# EasyEDA Pro project ProPrj_ESP32_四足机器人_2025-01-06.epro

# Schematic SCH_ESP32_四足机器人
Board Name: Board1_1; Create Date: 2024-11-19; Page Name: P1; Project Name: 毕设; Schematic Name: Schematic1_1; Update Date: 2024-11-26; Company: 嘉立创EDA; Page Size: A4; Version: V1.0
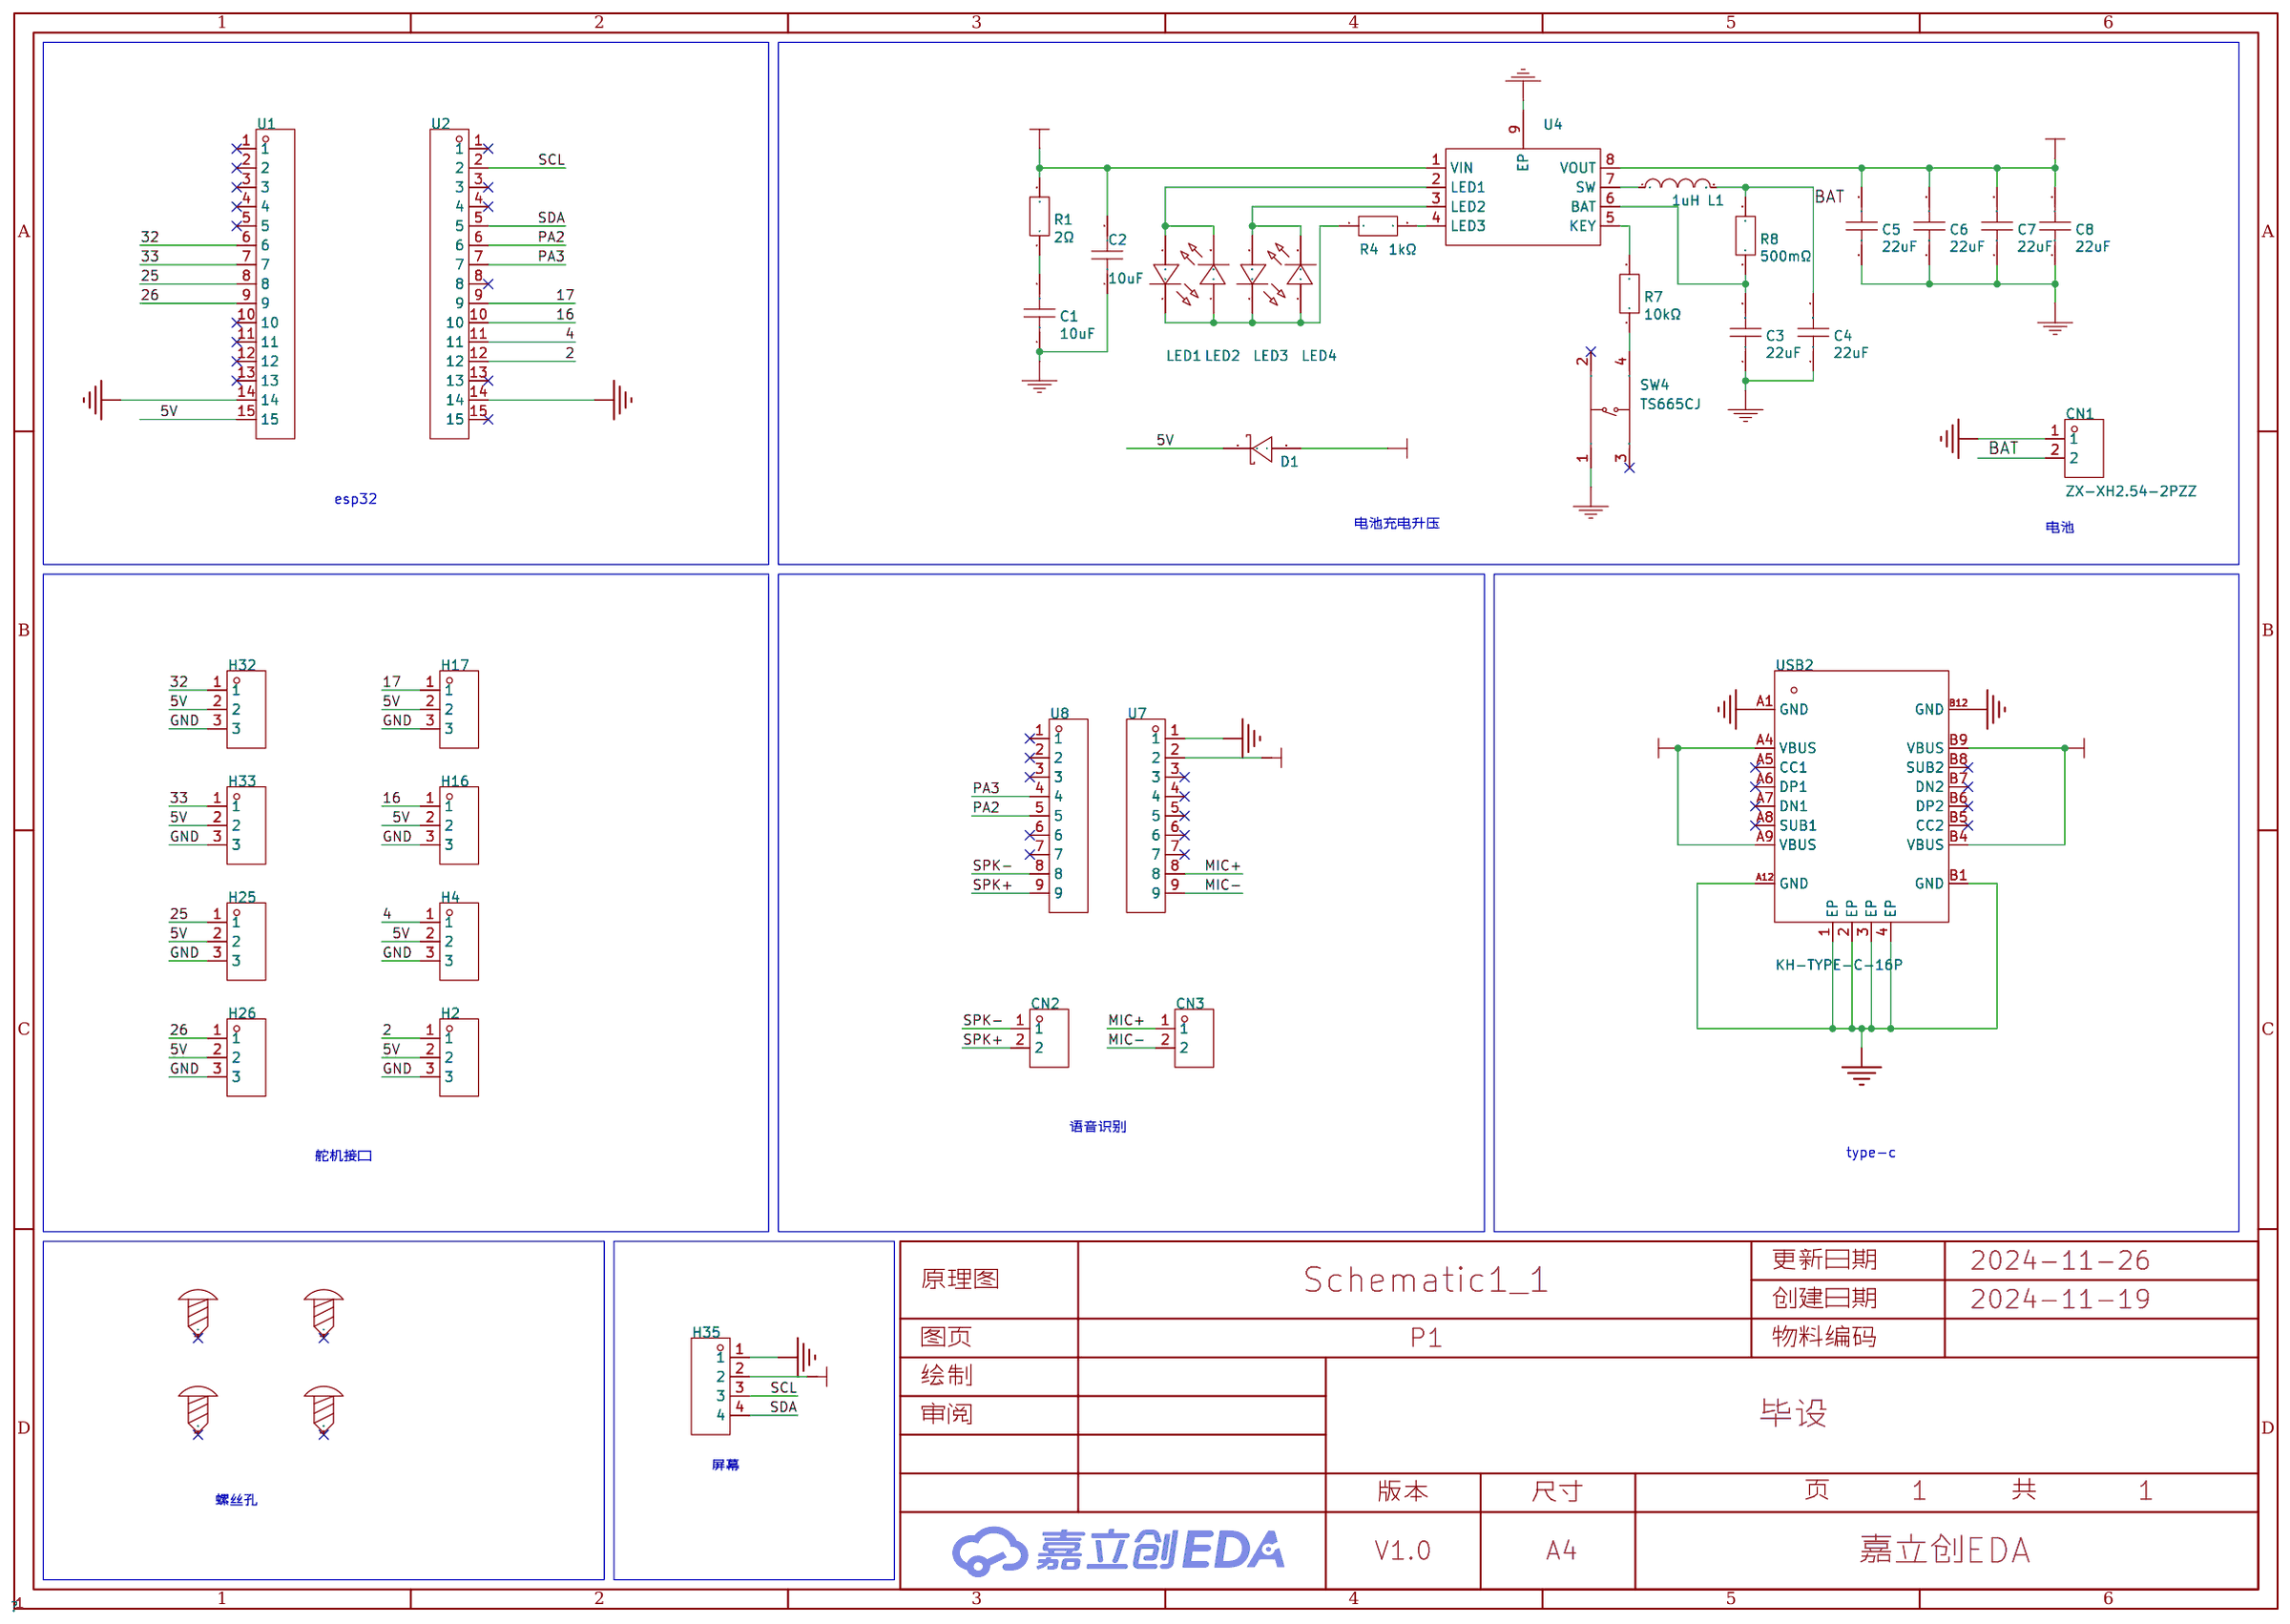
[diagram p0: schematic sheet]

## Parts
C1  10uF  [C0805]
C2  10uF  [C0805]
C3  22uF  [C0805]
C4  22uF  [C0805]
C5  22uF  [C0805]
C6  22uF  [C0805]
C7  22uF  [C0805]
C8  22uF  [C0805]
CN1  ZX-XH2.54-2PZZ  [CONN-TH_2P-P2.50_HX25003-2A]
CN2  ZX-XH2.54-2PZZ  [CONN-TH_2P-P2.50_HX25003-2A]
CN3  ZX-XH2.54-2PZZ  [CONN-TH_2P-P2.50_HX25003-2A]
D1  SS32  [SMA_L4.4-W2.8-LS5.4-RD]
H2  PZ254V-11-03P  [HDR-TH_3P-P2.54-V-M]
H4  PZ254V-11-03P  [HDR-TH_3P-P2.54-V-M]
H16  PZ254V-11-03P  [HDR-TH_3P-P2.54-V-M]
H17  PZ254V-11-03P  [HDR-TH_3P-P2.54-V-M]
H25  PZ254V-11-03P  [HDR-TH_3P-P2.54-V-M]
H26  PZ254V-11-03P  [HDR-TH_3P-P2.54-V-M]
H32  PZ254V-11-03P  [HDR-TH_3P-P2.54-V-M]
H33  PZ254V-11-03P  [HDR-TH_3P-P2.54-V-M]
H35  2.54-1*4P母  [HDR-TH_4P-P2.54-V-F]
L1  1uH  [IND-SMD_L7.1-W6.5-P5.60]
LED1  NCD0805G1  [LED0805-R-RD]
LED2  NCD0805G1  [LED0805-R-RD]
LED3  NCD0805G1  [LED0805-R-RD]
LED4  NCD0805G1  [LED0805-R-RD]
R1  2Ω  [R0805]
R4  1kΩ  [R0805]
R7  10kΩ  [R0805]
R8  500mΩ  [R0805]
SCREW1  -  [M4螺丝]
SCREW2  -  [M4螺丝]
SCREW3  -  [M4螺丝]
SCREW4  -  [M4螺丝]
SW4  TS665CJ  [SW-TH_4P-L6.0-W6.0-P4.50-LS6.5]
U1  KH-2.54FH-1X15P-H8.5  [HDR-TH_15P-P2.54-V-F]
U2  KH-2.54FH-1X15P-H8.5  [HDR-TH_15P-P2.54-V-F]
U4  IP5306  [ESOP-8_L4.9-W3.9-P1.27-LS6.0-BL-EP]
U7  PM254-1-09-Z-8.5  [HDR-TH_9P-P2.54-V-F]
U8  PM254-1-09-Z-8.5  [HDR-TH_9P-P2.54-V-F]
USB2  KH-TYPE-C-16P  [usb-c-smd_kh-type-c-16p]

## Library data of the parts
C1 C2 = CL21A106KPFNNNE: 容值:10uF;精度:±10%;额定电压:10V;材质(温度系数):X5R;; LCSC Part Name: 10uF ±10% 10V; Supplier Part: C17024; Manufacturer: SAMSUNG(三星); Supplier Footprint: 0805; JLCPCB Part Class: Extended Part; Datasheet: https://atta.szlcsc.com/upload/public/pdf/source/20160218/1457707763339.pdf; Supplier: LCSC; Tolerance: ±10%; Voltage Rated: 10V; Temperature Coefficient: X5R
C3-C8 = CL21A226MPQNNNE: 容值:22uF;精度:±20%;额定电压:10V;材质(温度系数):X5R;; LCSC Part Name: 22uF ±20% 10V; Supplier Part: C29277; Manufacturer: SAMSUNG(三星); Supplier Footprint: 0805; JLCPCB Part Class: Extended Part; Datasheet: https://atta.szlcsc.com/upload/public/pdf/source/20160218/1457707763339.pdf; Supplier: LCSC; Tolerance: ±20%; Voltage Rated: 10V; Temperature Coefficient: X5R
CN1-CN3 = ZX-XH2.54-2PZZ: 插针结构:1x2P;间距:2.54mm;安装方式:直插;参考系列:XH;总PIN数:2P;排数:1;每排PIN数:2;行距:-;额定电流:3A;触头材质:黄铜;触头镀层:锡;工作温度范围:-25℃~+85℃;; Supplier Part: C7429632; Manufacturer: Megastar(兆星); Supplier Footprint: 插件,P=2.54mm; JLCPCB Part Class: 扩展库; Datasheet: https://atta.szlcsc.com/upload/public/pdf/source/20230619/19BA6947230AA44A04D3EDD65E618FD0.pdf; Supplier: LCSC; Pins Structure: 1x2P; Pitch: 2.54mm; Mounting Style: 直插; Reference Series: XH; Number of Pins: 2P; Number of Rows: 1; Number of PINs Per Row: 2; Current Rating (Max): 3A; Contact Material: 黄铜; Contact Plating: 锡; Operating Temperature Range: -25℃~+85℃
D1 = SS32_C123938: 正向压降(Vf):550mV@3A;直流反向耐压(Vr):20V;平均整流电流(Io):3A;; LCSC Part Name: 电压:20V 电流:3A; Supplier Part: C123938; Manufacturer: 晶导微电子; Supplier Footprint: SMA(DO-214AC); JLCPCB Part Class: Extended Part; Datasheet: https://atta.szlcsc.com/upload/public/pdf/source/20170804/C123938_1501836222047866178.pdf; Supplier: LCSC; Forward Voltage (Vf@If): 550mV@3A; Reverse Voltage (Vr): 20V; Average Rectified Current (Io): 3A; Reverse Leakage Current (Ir): 500uA@20V; Peak forward surge current: 80A; JLCPCB SMD: Yes
H2 H4 H16 H17 H25 H26 H32 H33 = PZ254V-11-03P: 插针结构:1x3P;间距:2.54mm;行距:-;圆针/方针:方针;安装类型:直插;排数:单排;总PIN位数:3P;额定电流:3A;额定电压:250V;配合针长度:6mm;塑高:2.5mm;端接针长度:3mm;工作温度范围:-40℃~+105℃;颜色:黑色;; LCSC Part Name: 间距:2.54mm 1x3P 直插 方针; Supplier Part: C2937625; Manufacturer: XFCN(兴飞); Supplier Footprint: 插件,P=2.54mm; JLCPCB Part Class: 扩展库; Datasheet: https://atta.szlcsc.com/upload/public/pdf/source/20200309/C492402_8335C3D49C4E4C618838D59BB1D024C1.pdf; Supplier: LCSC; Pin Structure: 1x3P; Pitch: 2.54mm; Circluar Pins/Square Pins: 方针; Mounting Type: 直插; Number of Rows: 单排; Number of Pins: 3P; Current Rating (Max): 3A; Voltage Rating (Max): 250V; Length of Mating Pin: 6mm; Insulation Height: 2.5mm; Length of End Connection Pin: 3mm; Operating Temperature Range: -40℃~+105℃; Color: 黑色
H35 = 2.54-1*4P母: 插孔结构:1x4P;间距:2.54mm;行距:-;圆孔/方孔:方孔;安装类型:直插;排数:单排;总孔位数:4P;额定电流:3A;额定电压:-;插孔方向:顶部;塑高:-;触头材质:青铜;触头镀层:-;工作温度范围:-40℃~+105℃;焊接温度(最大值):-;; LCSC Part Name: 间距:2.54mm 1x4P 直插; Supplier Part: C2718488; Manufacturer: BOOMELE(博穆精密); Supplier Footprint: 插件,P=2.54mm; JLCPCB Part Class: 扩展库; Datasheet: https://atta.szlcsc.com/upload/public/pdf/source/20210301/C2718488_F4427B881E42CAA8DDB0B1C12B3A522C.pdf; Supplier: LCSC; Holes Structure: 1x4P; Pitch: 2.54mm; Circular Hole / Square Hole: 方孔; Mounting Type: 直插; Number of Rows: 单排; Number of Holes: 4P; Current Rating (Max): 3A; Holes Direction: 顶部; Contact Material: 青铜; Operating Temperature Range: -40℃~+105℃
L1 = SPM6530T-1R0M120: 电感值:1uH;精度:±20%;额定电流:13A;饱和电流(Isat):14.1A;类型:-;; LCSC Part Name: 1uH ±20% 14.1A; Supplier Part: C87572; Manufacturer: TDK; Supplier Footprint: SMD,7.1x6.5mm; JLCPCB Part Class: Extended Part; Datasheet: https://atta.szlcsc.com/upload/public/pdf/source/20161112/1478931671443.pdf; Supplier: LCSC; Tolerance: ±20%; Rated Current: 13A; Saturation Current (Isat): 14.1A; DC Resistance (DCR): 7.81mΩ
LED1-LED4 = NCD0805G1: 发光颜色:翠绿色;正向电压(VF):2.5V~3.6V;功率:72mW;正向电流:5mA;主波长:525nm~537.5nm;透镜颜色:无色透明透镜;发光强度:180mcd~400mcd;发光角度:130°;工作温度:-30℃~+85℃;; Supplier Part: C84260; Manufacturer: 国星光电; Supplier Footprint: 0805; JLCPCB Part Class: Extended Part; Datasheet: https://atta.szlcsc.com/upload/public/pdf/source/20200820/C84260_AFC7BF57C6FBA034D182BB8D10A67EFE.pdf; Supplier: LCSC; Emitted Color: 翠绿色; Forward Voltage (VF): 2.5V~3.6V; Power Dissipation: 72mW; Forward Current: 5mA; Dominant Wavelength: 525nm~537.5nm; Lens Color: 无色透明透镜; Luminous Intensity: 180mcd~400mcd; Viewing Angle: 130°; Operating Temperature: -30℃~+85℃
R1 = FRC0805J2R0TS: 电阻类型:厚膜电阻;阻值:2Ω;精度:±5%;功率:125mW;最大工作电压:150V;温度系数:±200ppm/℃;; LCSC Part Name: 2Ω ±5% 125mW 厚膜电阻; Supplier Part: C2930265; Manufacturer: FOJAN(富捷); Supplier Footprint: 0805; JLCPCB Part Class: Extended Part; Datasheet: https://atta.szlcsc.com/upload/public/pdf/source/20211221/925EC7D7225764EE0046F22065062C87.pdf; Supplier: LCSC; Type: 厚膜电阻; Tolerance: ±5%; Power(Watts): 125mW; Overload Voltage (Max): 150V; Temperature Coefficient: ±200ppm/℃; Operating Temperature Range: -55℃~+155℃
R4 = 0805W8F1001T5E: 电阻类型:厚膜电阻;阻值:1kΩ;精度:±1%;功率:125mW;最大工作电压:150V;温度系数:±100ppm/℃;; LCSC Part Name: 1kΩ ±1% 125mW 厚膜电阻; Supplier Part: C17513; Manufacturer: UNI-ROYAL(厚声); Supplier Footprint: 0805; JLCPCB Part Class: Basic Part; Datasheet: https://atta.szlcsc.com/upload/public/pdf/source/20200306/C422600_1E6D84923E4A46A82E41ADD87F860B5C.pdf; Supplier: LCSC; Type: 厚膜电阻; Tolerance: ±1%; Power(Watts): 125mW; Overload Voltage (Max): 150V; Temperature Coefficient: ±100ppm/℃; Operating Temperature Range: -55℃~+155℃
R7 = 0805W8F1002T5E_C17414: 电阻类型:厚膜电阻;阻值:10kΩ;精度:±1%;功率:125mW;最大工作电压:150V;温度系数:±100ppm/℃;; LCSC Part Name: 10kΩ ±1% 125mW 厚膜电阻; Supplier Part: C17414; Manufacturer: UNI-ROYAL(厚声); Manufacturer Part: 0805W8F1002T5E; Supplier Footprint: 0805; JLCPCB Part Class: Basic Part; Datasheet: https://atta.szlcsc.com/upload/public/pdf/source/20200306/C422600_1E6D84923E4A46A82E41ADD87F860B5C.pdf; Supplier: LCSC; Type: 厚膜电阻; Tolerance: ±1%; Power(Watts): 125mW; Overload Voltage (Max): 150V; Temperature Coefficient: ±100ppm/℃; Operating Temperature Range: -55℃~+155℃
R8 = FRL0805JR500TS: 电阻类型:厚膜电阻;阻值:500mΩ;精度:±5%;功率:125mW;最大工作电压:300V;温度系数:±300ppm/℃;; LCSC Part Name: 500mΩ ±5% 125mW 厚膜电阻; Supplier Part: C2934281; Manufacturer: FOJAN(富捷); Supplier Footprint: 0805; JLCPCB Part Class: Extended Part; Datasheet: https://atta.szlcsc.com/upload/public/pdf/source/20211221/925EC7D7225764EE0046F22065062C87.pdf; Supplier: LCSC; Type: 厚膜电阻; Tolerance: ±5%; Power(Watts): 125mW; Overload Voltage (Max): 300V; Temperature Coefficient: ±300ppm/℃; Operating Temperature Range: -55℃~+155℃
SCREW1-SCREW4 = M4螺丝: Supplier Footprint: 插件; Check: false
SW4 = TS665CJ: 电路结构:单刀单掷;按钮形状:圆形按钮;安装方式:直插;开关长度:6mm;开关宽度:6mm;开关高度:5mm;触点电流:50mA;额定电压(DC):12V;带灯:-;机械寿命:-;; LCSC Part Name: 6*6*5mm 直插 轻触开关; Supplier Part: C393938; Manufacturer: SHOU HAN(首韩); Supplier Footprint: 插件; JLCPCB Part Class: 扩展库; Datasheet: https://atta.szlcsc.com/upload/public/pdf/source/20190521/C393938_BDABEAC600B4C55E200A80AA129B70BC.pdf; Supplier: LCSC; Circuit: 单刀单掷; Actuator Style: 圆形按钮; Mounting Style: 直插; Switch Length: 6mm; Switch Width: 6mm; Switch Height: 5mm; Contact Current: 50mA; Voltage Rating (DC): 12V
U1 U2 = KH-2.54FH-1X15P-H8.5: 插孔结构:1x15P;间距:2.54mm;行距:-;圆孔/方孔:方孔;安装类型:直插;排数:单排;总孔位数:15P;额定电流:3A;额定电压:-;插孔方向:顶部;塑高:8.5mm;工作温度范围:-40℃~+105℃;; LCSC Part Name: 间距:2.54mm 1x15P 直插; Supplier Part: C2932676; Manufacturer: kinghelm(金航标); Supplier Footprint: 插件,P=2.54mm; JLCPCB Part Class: 扩展库; Datasheet: https://atta.szlcsc.com/upload/public/pdf/source/20211220/977AA415CFA981E866620A80068F25CA.pdf; Supplier: LCSC; Holes Structure: 1x15P; Pitch: 2.54mm; Circular Hole / Square Hole: 方孔; Mounting Type: 直插; Number of Rows: 单排; Number of Holes: 15P; Current Rating (Max): 3A; Holes Direction: 顶部; Insulation Height: 8.5mm; Operating Temperature Range: -40℃~+105℃; Check: true
U4 = IP5306: 2.1A充电2.4A放电高集成度移动电源SOC; Supplier Part: C181692; Manufacturer: INJOINIC(英集芯); Supplier Footprint: ESOP-8; JLCPCB Part Class: Extended Part; Datasheet: https://atta.szlcsc.com/upload/public/pdf/source/20190627/C384572_9925B3DDC4041BC6108E5AB46A2A0AB1.pdf; Supplier: LCSC
U7 = PM254-1-09-Z-8.5: 插孔结构:1x9P;间距:2.54mm;行距:-;圆孔/方孔:方孔;安装类型:直插;排数:单排;总孔位数:9P;额定电流:3A;额定电压:-;插孔方向:顶部;塑高:8.5mm;触头材质:铜合金;工作温度范围:-40℃~+105℃;焊接温度(最大值):260℃@5S;; LCSC Part Name: 1x9P 间距:2.54mm 直插; Supplier Part: C2897372; Manufacturer: HCTL(华灿天禄); Supplier Footprint: 插件,P=2.54mm; JLCPCB Part Class: 扩展库; Datasheet: https://atta.szlcsc.com/upload/public/pdf/source/20230609/534BE42964C679BDE98E061007C4ABD6.pdf; Supplier: LCSC; Holes Structure: 1x9P; Pitch: 2.54mm; Circular Hole / Square Hole: 方孔; Mounting Type: 直插; Number of Rows: 单排; Number of Holes: 9P; Current Rating (Max): 3A; Holes Direction: 顶部; Insulation Height: 8.5mm; Contact Material: 铜合金; Operating Temperature Range: -40℃~+105℃; Soldering Temperature(Max): 260℃@5S
U8 = PM254-1-09-Z-8.5: 插孔结构:1x9P;间距:2.54mm;行距:-;圆孔/方孔:方孔;安装类型:直插;排数:单排;总孔位数:9P;额定电流:3A;额定电压:-;插孔方向:顶部;塑高:8.5mm;触头材质:铜合金;工作温度范围:-40℃~+105℃;焊接温度(最大值):260℃@5S;; LCSC Part Name: 1x9P 间距:2.54mm 直插; Supplier Part: C2897372; Manufacturer: HCTL(华灿天禄); Supplier Footprint: 插件,P=2.54mm; JLCPCB Part Class: Extended Part; Datasheet: https://atta.szlcsc.com/upload/public/pdf/source/20230609/534BE42964C679BDE98E061007C4ABD6.pdf; Supplier: LCSC; Holes Structure: 1x9P; Pitch: 2.54mm; Circular Hole / Square Hole: 方孔; Mounting Type: 直插; Number of Rows: 单排; Number of Holes: 9P; Current Rating (Max): 3A; Holes Direction: 顶部; Insulation Height: 8.5mm; Contact Material: 铜合金; Operating Temperature Range: -40℃~+105℃; Soldering Temperature(Max): 260℃@5S
USB2 = KH-TYPE-C-16P: 连接器类型:Type-C;标准:-;公母:母;端口数量:1;触点数量:16P;安装方式:卧贴;额定电流 - 电源:3A;工作温度范围:-40℃~+85℃;; LCSC Part Name: Type-C 母 卧贴; Supplier Part: C709357; Manufacturer: kinghelm(金航标); Supplier Footprint: SMD; JLCPCB Part Class: 扩展库; Datasheet: https://atta.szlcsc.com/upload/public/pdf/source/20200911/C709357_AA8DCEB38BB20E3035A7ED7AE7667837.pdf; Supplier: LCSC; Connector Type: Type-C; Gender: 母; Number of Ports: 1; Number of Contacts: 16P; Mounting Style: 卧贴; Current Rating - Power (Max): 3A; Operating Temperature Range: -40℃~+85℃

## Nets
5V: D1.1(K) H2.2 H4.2 H16.2 H17.2 H25.2 H26.2 H32.2 H33.2 H35.2 U1.15 U7.2
5VOUT: C5.2 C6.2 C7.2 C8.2 D1.2(A) U4.8(VOUT)
GND: C1.1 C2.1 C3.1 C4.1 C5.1 C6.1 C7.1 C8.1 CN1.1 H2.3 H4.3 H16.3 H17.3 H25.3 H26.3 H32.3 H33.3 H35.1 SW4.1(A) U1.14 U2.14 U4.9(EP) U7.1 USB2.1(EP) USB2.2(EP) USB2.3(EP) USB2.4(EP) USB2.A1(GND) USB2.A12(GND) USB2.B1(GND) USB2.B12(GND)
VIN: C2.2 R1.2 U4.1(VIN) USB2.A4(VBUS) USB2.A9(VBUS) USB2.B4(VBUS) USB2.B9(VBUS)
2: H2.1 U2.12
4: H4.1 U2.11
16: H16.1 U2.10
17: H17.1 U2.9
25: H25.1 U1.8
26: H26.1 U1.9
32: H32.1 U1.6
33: H33.1 U1.7
BAT: C4.2 CN1.2 L1.2 R8.2
MIC+: CN3.1 U7.8
MIC-: CN3.2 U7.9
PA2: U2.6 U8.5
PA3: U2.7 U8.4
SCL: H35.3 U2.2
SDA: H35.4 U2.5
SPK+: CN2.2 U8.9
SPK-: CN2.1 U8.8
$1N4161: L1.1 U4.7(SW)
$1N4164: R7.2 U4.5(KEY)
$1N4167: C3.2 R8.1 U4.6(BAT)
$1N4173: LED1.1 LED2.2 U4.2(LED1)
$1N4198: R4.2 U4.4(LED3)
$1N4199: C1.2 R1.1
$1N19106: R7.1 SW4.4(D)
Net-(LED1-2): LED1.2 LED2.1 LED3.2 LED4.1 R4.1
Net-(LED3-1): LED3.1 LED4.2 U4.3(LED2)

Not connected (* = marked no-connect by the designer): SCREW1 1*; SCREW2 1*; SCREW3 1*; SCREW4 1*; SW4 2(B)* 3(C)*; U1 1* 2* 3* 4* 5* 10* 11* 12* 13*; U2 1* 3* 4* 8* 13* 15*; U7 3* 4* 5* 6* 7*; U8 1* 2* 3* 6* 7*; USB2 A5(CC1)* A6(DP1)* A7(DN1)* A8(SUB1)* B5(CC2)* B6(DP2)* B7(DN2)* B8(SUB2)*

## Notes on the sheet
- esp32
- 电池充电升压
- 电池
- 语音识别
- 舵机接口
- type-c
- 屏幕
- 螺丝孔

# Board PCB_ESP32_四足机器人
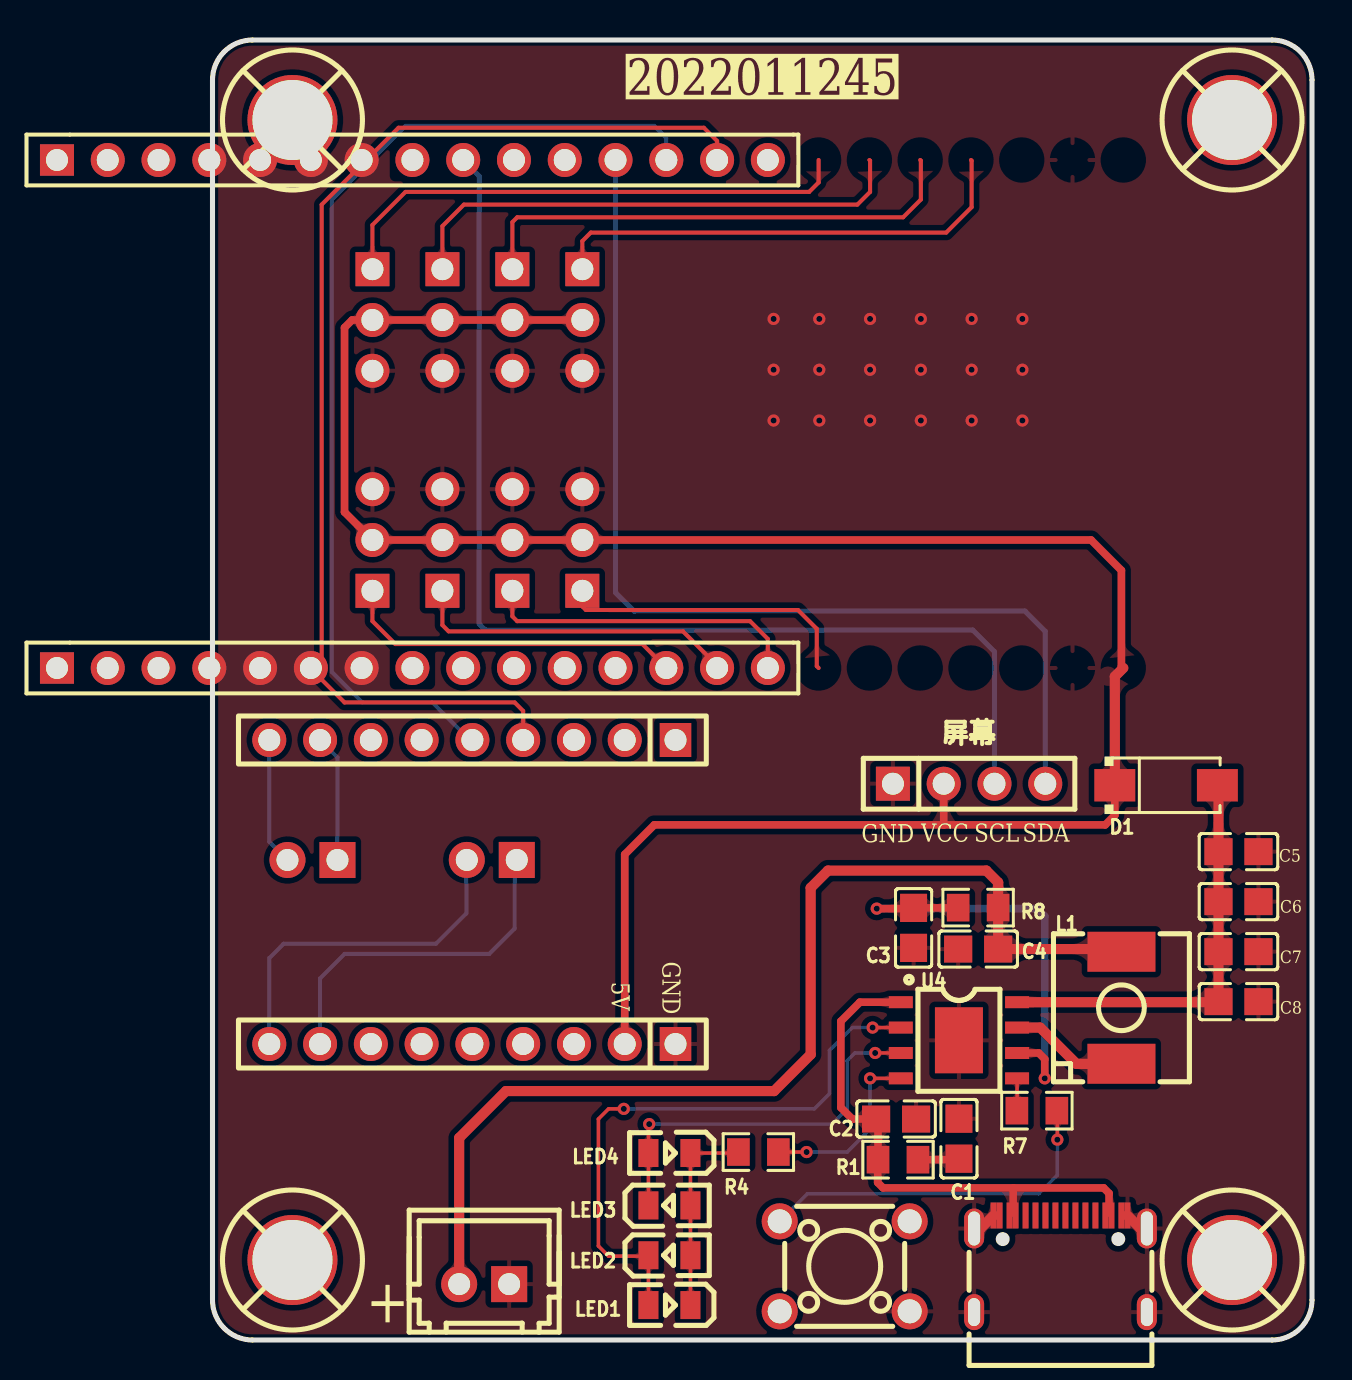
[diagram p1: board, top side]
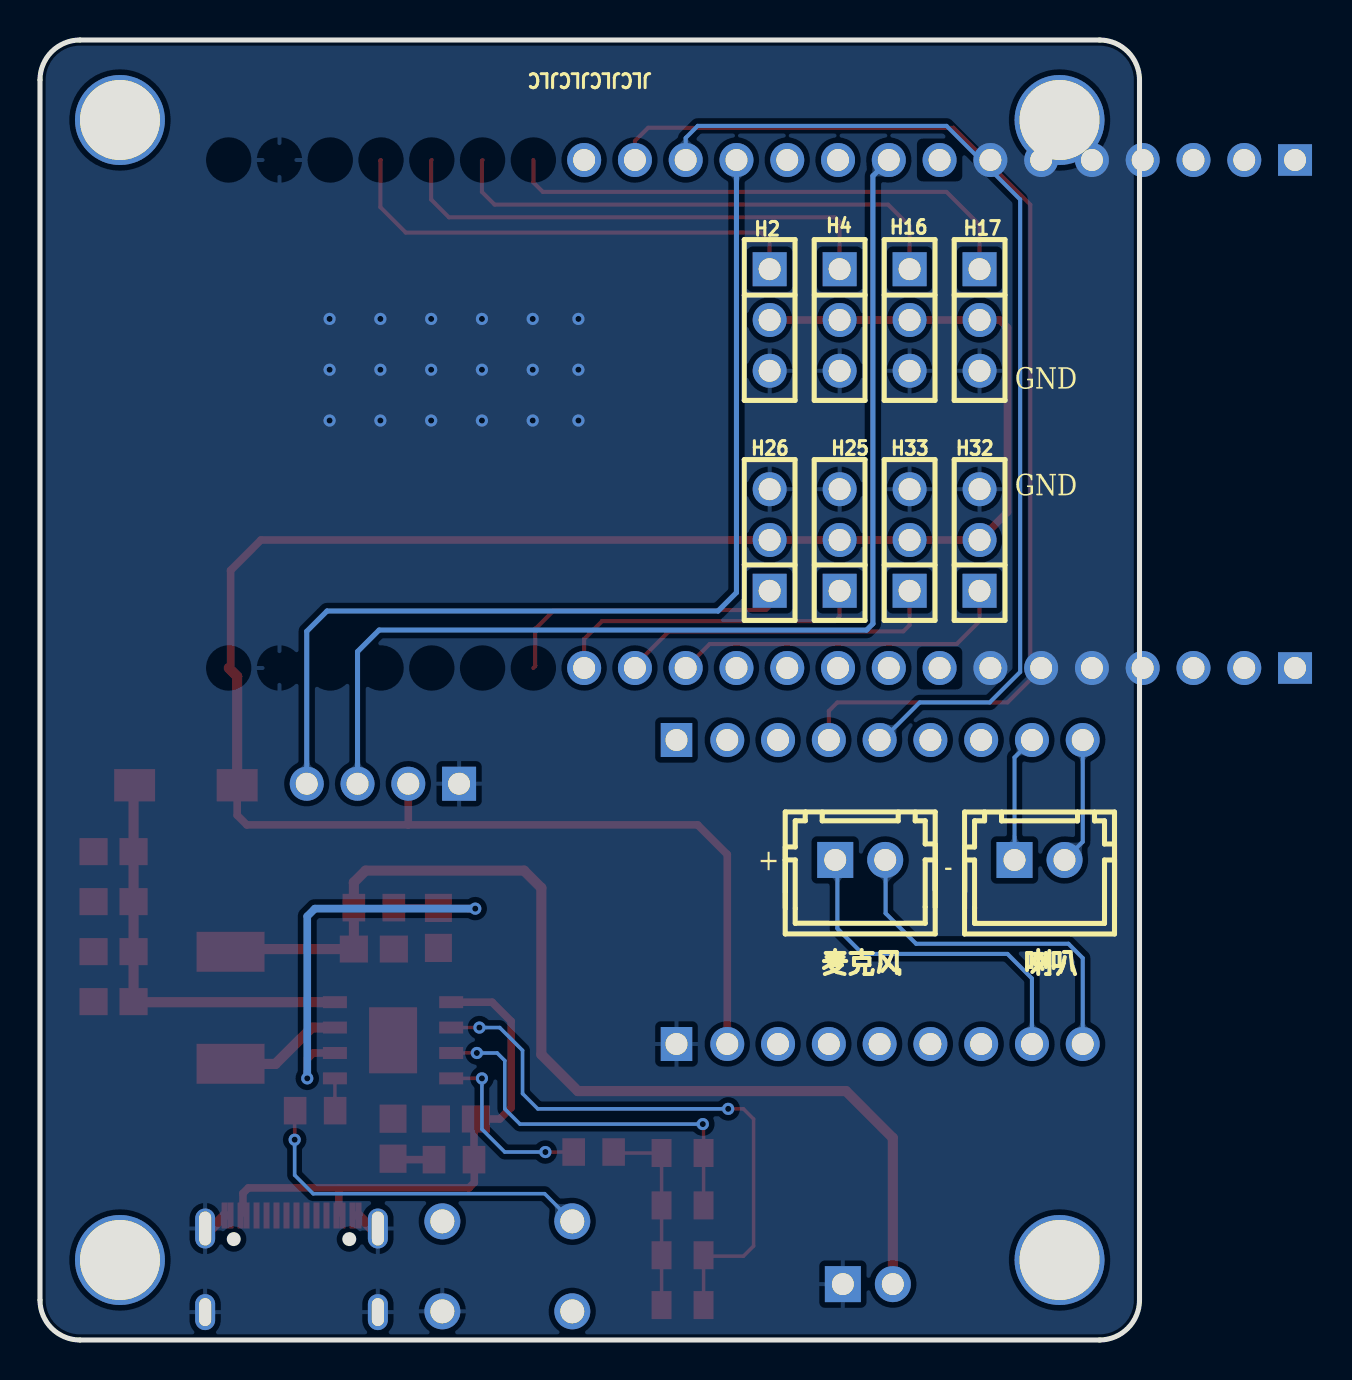
[diagram p2: board, bottom side, seen from below]

Outline 55 x 65 mm; copper layers: Top Layer, Bottom Layer. Coordinates in mm from the lower left corner of the outline.
Outline path: 0,63 0,2 arc(0.59,0.59) 2,0 53,0 arc(54.41,0.59) 55,2 55,63 arc(54.41,64.41) 53,65 2,65 arc(0.59,64.41) 0,63
Stack: Top Layer 0.035mm / Dielectric1 1.51mm FR4 er 4.5 / Bottom Layer 0.035mm

## Design rules (mm)
template: 自定义配置
spacing copperThickness1oz: track to track 0.102, other pairs 0.152 to 0.3
spacing copperThickness2oz (default): track to track 0.203, other pairs 0.152 to 0.3
track width 信号线 (default): min 0.127, default 0.178, max 2.54
track width vcc: min 0.178, default 0.381, max 2.54
track width gnd: min 0.254, default 0.508, max 2.54
differential pair differentialPair (default): width min 0.127, default 0.254, max 2.54; gap min 0.152, default 0.152
via viaSize (default): diameter min 0.5, default 0.61, max 10; hole min 0.3, default 0.305, max 6.299
net GND uses gnd
net VIN uses vcc
net 5VOUT uses vcc
net BAT uses vcc
net 5V uses vcc

## Placement (name value [footprint] x y rotation side)
C1  10uF  [C0805]  37.34 10.06 270 top
C2  10uF  [C0805]  34.19 11.05 180 top
C3  22uF  [C0805]  35.07 20.61 90 top
C4  22uF  [C0805]  38.3 19.55 0 top
C5  22uF  [C0805]  51.32 24.42 180 top
C6  22uF  [C0805]  51.32 21.92 180 top
C7  22uF  [C0805]  51.32 19.42 180 top
C8  22uF  [C0805]  51.32 16.92 180 top
CN1  ZX-XH2.54-2PZZ  [CONN-TH_2P-P2.50_HX25003-2A]  13.59 2.79 180 top
CN2  ZX-XH2.54-2PZZ  [CONN-TH_2P-P2.50_HX25003-2A]  5 24 180 bottom
CN3  ZX-XH2.54-2PZZ  [CONN-TH_2P-P2.50_HX25003-2A]  13.97 24 180 bottom
D1  SS32  [SMA_L4.4-W2.8-LS5.4-RD]  47.7 27.74 0 top
H2  PZ254V-11-03P  [HDR-TH_3P-P2.54-V-M]  18.5 51 270 bottom
H4  PZ254V-11-03P  [HDR-TH_3P-P2.54-V-M]  15 51 270 bottom
H16  PZ254V-11-03P  [HDR-TH_3P-P2.54-V-M]  11.5 51 270 bottom
H17  PZ254V-11-03P  [HDR-TH_3P-P2.54-V-M]  8 51 270 bottom
H25  PZ254V-11-03P  [HDR-TH_3P-P2.54-V-M]  15 40 90 bottom
H26  PZ254V-11-03P  [HDR-TH_3P-P2.54-V-M]  18.5 40 90 bottom
H32  PZ254V-11-03P  [HDR-TH_3P-P2.54-V-M]  8 40 90 bottom
H33  PZ254V-11-03P  [HDR-TH_3P-P2.54-V-M]  11.5 40 90 bottom
H35  2.54-1*4P母  [HDR-TH_4P-P2.54-V-F]  37.85 27.81 0 top
L1  1uH  [IND-SMD_L7.1-W6.5-P5.60]  45.47 16.61 90 top
LED1  NCD0805G1  [LED0805-R-RD]  22.86 1.75 180 top
LED2  NCD0805G1  [LED0805-R-RD]  22.86 4.24 0 top
LED3  NCD0805G1  [LED0805-R-RD]  22.86 6.73 0 top
LED4  NCD0805G1  [LED0805-R-RD]  22.86 9.35 180 top
R1  2Ω  [R0805]  34.29 9.02 180 top
R4  1kΩ  [R0805]  27.31 9.4 0 top
R7  10kΩ  [R0805]  41.24 11.47 180 top
R8  500mΩ  [R0805]  38.3 21.62 0 top
SCREW1  -  [M4螺丝]  4 4 0 top
SCREW2  -  [M4螺丝]  51 4 0 top
SCREW3  -  [M4螺丝]  4 61 0 top
SCREW4  -  [M4螺丝]  51 61 0 top
SW4  TS665CJ  [SW-TH_4P-L6.0-W6.0-P4.50-LS6.5]  31.62 3.68 180 top
U1  KH-2.54FH-1X15P-H8.5  [HDR-TH_15P-P2.54-V-F]  10 33.6 0 top
U2  KH-2.54FH-1X15P-H8.5  [HDR-TH_15P-P2.54-V-F]  10 59 0 top
U4  IP5306  [ESOP-8_L4.9-W3.9-P1.27-LS6.0-BL-EP]  37.34 14.99 270 top
U7  PM254-1-09-Z-8.5  [HDR-TH_9P-P2.54-V-F]  13 14.8 180 top
U8  PM254-1-09-Z-8.5  [HDR-TH_9P-P2.54-V-F]  13 30 180 top
USB2  KH-TYPE-C-16P  [usb-c-smd_kh-type-c-16p]  42.42 3.81 0 top

## Footprints (pads in the part's own frame, mm; a bottom-side part is the same pattern mirrored in y, then rotated)
C0805
  rect 1.41x1.35 smd: 1(-1,0) 2(1,0)
CONN-TH_2P-P2.50_HX25003-2A
  rect 1.8x1.8 hole 1.1: 1(-1.25,0)
  round 1.8 hole 1.1: 2(1.25,0)
ESOP-8_L4.9-W3.9-P1.27-LS6.0-BL-EP
  rect 0.6x1.2 smd: 1(-1.905,-2.909) 2(-0.635,-2.909) 3(0.635,-2.909) 4(1.905,-2.909) 5(1.905,2.909) 6(0.635,2.909) 7(-0.635,2.909) 8(-1.905,2.909)
  rect 3.3x2.4 smd: 9(0,0)
HDR-TH_3P-P2.54-V-M
  rect 1.7x1.7 hole 1.1: 1(-2.54,0)
  round 1.7 hole 1.1: 2(0,0) 3(2.54,0)
HDR-TH_4P-P2.54-V-F
  rect 1.7x1.7 hole 1.1: 1(-3.81,0)
  round 1.7 hole 1.1: 2(-1.27,0) 3(1.27,0) 4(3.81,0)
HDR-TH_9P-P2.54-V-F
  rect 1.575x1.7 hole 1.1: 1(-10.16,0)
  round 1.7 hole 1.1: 2(-7.62,0) 3(-5.08,0) 4(-2.54,0) 5(0,0) 6(2.54,0) 7(5.08,0) 8(7.62,0) 9(10.16,0)
HDR-TH_15P-P2.54-V-F
  rect 1.7x1.575 hole 1.1: 1(-17.78,0)
  round 1.7 hole 1.1: 2(-15.24,0) 3(-12.7,0) 4(-10.16,0) 5(-7.62,0) 6(-5.08,0) 7(-2.54,0) 8(0,0) 9(2.54,0) 10(5.08,0) 11(7.62,0) 12(10.16,0) 13(12.7,0) 14(15.24,0) 15(17.78,0)
IND-SMD_L7.1-W6.5-P5.60
  rect 2x3.4 smd: 1(-2.8,0) 2(2.8,0)
LED0805-R-RD
  rect 1x1.399 smd: 1(1.05,0) 2(-1.05,0)
M4螺丝
  round 4.5 hole 4: 1(0,0)
R0805
  rect 1.133x1.377 smd: 1(-1,0) 2(1,0)
SMA_L4.4-W2.8-LS5.4-RD
  rect 2.046x1.62 smd: 1(-2.566,0) 2(2.566,0)
SW-TH_4P-L6.0-W6.0-P4.50-LS6.5
  round 1.8 hole 1.2: 1(-3.25,2.25) 2(3.25,2.25) 3(-3.25,-2.25) 4(3.25,-2.25)
usb-c-smd_kh-type-c-16p
  oval 1x2 hole 0.6x1.7: 1(-4.32,1.765) 2(4.32,1.765)
  oval 1x1.8 hole 0.6x1.4: 3(-4.32,-2.415) 4(4.32,-2.415)
  rect 0.3x1.3 smd: A1(-3.35,2.415) A4(-2.55,2.415) A5(-1.25,2.415) A6(-0.25,2.415) A7(0.25,2.415) A8(1.25,2.415) A9(2.55,2.415) A12(3.35,2.415) B1(3.05,2.415) B4(2.25,2.415) B5(1.75,2.415) B6(0.75,2.415) B7(-0.75,2.415) B8(-1.75,2.415) B9(-2.25,2.415) B12(-3.05,2.415)

## Nets
As in the schematic, except:
$1N4185: LED1.2 LED2.1 LED3.1 LED4.2 R4.1
$1N4186: LED3.2 LED4.1 U4.3

Pads without a net: SCREW1 1; SCREW2 1; SCREW3 1; SCREW4 1; SW4 2 3; U1 1 2 3 4 5 10 11 12 13; U2 1 3 4 8 13 15; U7 3 4 5 6 7; U8 1 2 3 6 7; USB2 A5 A6 A7 A8 B5 B6 B7 B8

## Via types
v1: diameter 0.61, hole 0.305, Top Layer to Bottom Layer, 27 vias

## Routing (per net, layer and track width the routed paths; a pad name or vN(x,y) marks a point on that pad's centre or on a via; arc(x,y) is an arc through that point)
5V: length 110.7
  Top Layer w0.381: D1.1 45.14,26.24 44.65,25.76 36.58,25.76 ; 45.56,33.6 45.47,33.69 45.47,38.48 43.95,40 H26.2 H25.2 H33.2 H32.2 6.6,41.4 6.6,50.62 6.98,51 H17.2 H16.2 H4.2 H2.2 ; U7.2 20.62,24.28 22.1,25.76 36.58,25.76 ; 36.58,25.76 36.58,25.76 H35.2
  Top Layer w0.508: 45.56,33.6 45.14,33.18 D1.1
5VOUT: length 20.9
  Top Layer w0.508: D1.2 50.32,27.68 C5.2 C6.2 C7.2 C8.2 50.29,16.89 U4.8
GND: length 2.5
  Top Layer w0.508: USB2.1 38.42,5.57 USB2.A1 ; USB2.A12 46.42,5.57 USB2.2
  vias: v1(28.07,51.05) v1(28.07,48.51) v1(28.07,45.97) v1(30.35,51.05) v1(30.35,48.51) v1(30.35,45.97) v1(32.89,51.05) v1(32.89,48.51) v1(32.89,45.97) v1(35.43,51.05) v1(35.43,48.51) v1(35.43,45.97) v1(37.97,51.05) v1(37.97,48.51) v1(37.97,45.97) v1(40.51,51.05) v1(40.51,48.51) v1(40.51,45.97)
VIN: length 27
  Top Layer w0.381: U4.1 32.38,16.89 31.43,15.94 31.43,11.62 32,11.05 C2.2 33.29,10.95 R1.2 33.27,9 33.27,7.87 33.54,7.6 40.05,7.6 ; 40.05,7.6 40.05,6.34 ; 40.05,7.6 44.58,7.6 44.85,7.34 44.85,6.35
2: length 24
  Top Layer w0.203: 37.94,59 37.97,58.97 37.97,56.64 36.7,55.37 18.92,55.37 18.5,54.95 H2.1
4: length 25.2
  Top Layer w0.203: H4.1 15,55.89 15.24,56.13 34.54,56.13 35.43,57.02 35.43,58.97 35.4,59
16: length 25.9
  Top Layer w0.203: H16.1 11.5,55.7 12.57,56.77 32.26,56.77 32.89,57.4 32.89,58.97 32.86,59
17: length 26.5
  Top Layer w0.203: 30.32,59 30.32,57.88 29.84,57.4 9.65,57.4 8,55.75 H17.1
25: length 16
  Top Layer w0.203: H25.1 15,36.18 15.24,35.94 26.89,35.94 27.78,35.05 27.78,33.6
26: length 15
  Top Layer w0.203: H26.1 18.5,36.68 18.68,36.5 29.29,36.5 30.23,35.56 30.23,33.69 30.32,33.6
32: length 17.2
  Top Layer w0.203: 22.7,33.6 21.5,34.8 9.14,34.8 8,35.94 H32.1
33: length 16.4
  Top Layer w0.203: 25.24,33.6 25.24,33.73 23.53,35.43 11.81,35.43 11.5,35.74 H33.1
BAT: length 54.2
  Top Layer w0.508: R8.2 C4.2 45.33,19.55 L1.2 ; CN1.2 12.34,10.1 14.68,12.45 28.09,12.45 29.92,14.28 29.92,22.61 30.78,23.47 38.71,23.47 39.3,22.88 39.3,21.87
MIC+: length 17.5
  Bottom Layer w0.203: U7.8 5.38,18.08 6.6,19.3 13.84,19.3 15.11,20.57 15.11,23.9 CN3.1
MIC-: length 17.8
  Bottom Layer w0.203: CN3.2 12.7,23.98 12.7,21.34 11.18,19.81 3.56,19.81 2.84,19.1 U7.9
PA2: length 51.7
  Bottom Layer w0.203: 22.7,59 22.7,60.1 22.1,60.71 9.65,60.71 5.97,57.02 5.97,33.4 7.49,31.88 11,31.88 12.87,30 U8.5
PA3: length 58.5
  Top Layer w0.203: U8.4 15.54,31.45 15.11,31.88 6.6,31.88 5.46,33.02 5.46,56.77 9.3,60.61 24.58,60.61 25.24,59.95 25.24,59
SCL: length 56.5
  Bottom Layer w0.254: 12.54,59 13.34,58.2 13.34,35.81 13.65,35.5 38.04,35.5 39.12,34.42 H35.3
SDA: length 51.5
  Bottom Layer w0.254: H35.4 41.66,35.43 40.64,36.45 21.08,36.45 20.16,37.37 20.16,59
SPK+: length 6.4
  Bottom Layer w0.203: CN2.2 2.84,24.91 U8.9
SPK-: length 6.4
  Bottom Layer w0.203: U8.8 6.25,29.13 CN2.1
$1N4161: length 6
  Top Layer w0.508: 40.25,15.62 41.4,15.62 43.22,13.81 45.46,13.81 L1.1
$1N4164: length 1.6
  Top Layer w0.178: R7.2 40.25,11.48 U4.5
$1N4167: length 23.2
  Top Layer w0.381: R8.1 37.29,21.61 C3.2 35.03,21.57 v1(33.23,21.57) ; U4.6 41.33,14.35 41.63,14.05 v1(41.63,13.08)
  Bottom Layer w0.381: v1(41.63,13.08) 41.63,21.19 41.25,21.57 v1(33.23,21.57)
$1N4173: length 29.9
  Top Layer w0.178: 34.43,15.62 v1(33.02,15.62) ; v1(20.57,11.56) 19.81,11.56 19.3,11.05 19.3,4.7 19.81,4.19 21.76,4.19 LED2.2 LED1.1
  Bottom Layer w0.178: v1(20.57,11.56) 30.1,11.56 30.86,12.32 30.86,14.48 32,15.62 v1(33.02,15.62)
$1N4185: length 10
  Top Layer w0.178: R4.1 26.26,9.35 LED4.2 LED3.1 LED2.1 LED1.2
$1N4186: length 19.6
  Top Layer w0.178: LED3.2 LED4.1 21.81,10.63 21.84,10.67 v1(21.84,10.79) ; U4.3 v1(33.15,14.35)
  Bottom Layer w0.178: v1(33.15,14.35) 32.13,14.35 31.75,13.97 31.75,11.56 30.99,10.79 v1(21.84,10.79)
$1N4198: length 9.1
  Top Layer w0.178: v1(29.72,9.4) R4.2 ; U4.4 v1(32.89,13.08)
  Bottom Layer w0.178: v1(29.72,9.4) 31.75,9.4 32.89,10.54 v1(32.89,13.08)
$1N4199: length 2
  Top Layer w0.381: R1.1 37.29,9.02
$1N19106: length 18.1
  Top Layer w0.178: v1(42.26,10.02) 42.26,11.44 R7.1
  Bottom Layer w0.178: SW4.4 29.76,7.31 41.33,7.31 42.26,8.24 v1(42.26,10.02)

## Copper pours and planes (outline as drawn; the poured copper is in the pictures)
GND on Top Layer: 0,63 0.02,63.28 0.08,63.56 0.18,63.83 0.32,64.08 0.49,64.31 0.69,64.51 0.92,64.68 1.17,64.82 1.44,64.92 1.72,64.98 2,65 53,65 53.28,64.98 53.56,64.92 53.83,64.82 54.08,64.68 54.31,64.51 54.51,64.31 54.68,64.08 54.82,63.83 54.92,63.56 54.98,63.28 55,63 55,2 54.98,1.72 54.92,1.44 54.82,1.17 54.68,0.92 54.51,0.69 54.31,0.49 54.08,0.32 53.83,0.18 53.56,0.08 53.28,0.02 53,0 2,0 1.72,0.02 1.44,0.08 1.17,0.18 0.92,0.32 0.69,0.49 0.49,0.69 0.32,0.92 0.18,1.17 0.08,1.44 0.02,1.72 0,2
GND on Bottom Layer: 0,63 0.02,63.28 0.08,63.56 0.18,63.83 0.32,64.08 0.49,64.31 0.69,64.51 0.92,64.68 1.17,64.82 1.44,64.92 1.72,64.98 2,65 53,65 53.28,64.98 53.56,64.92 53.83,64.82 54.08,64.68 54.31,64.51 54.51,64.31 54.68,64.08 54.82,63.83 54.92,63.56 54.98,63.28 55,63 55,2 54.98,1.72 54.92,1.44 54.82,1.17 54.68,0.92 54.51,0.69 54.31,0.49 54.08,0.32 53.83,0.18 53.56,0.08 53.28,0.02 53,0 2,0 1.72,0.02 1.44,0.08 1.17,0.18 0.92,0.32 0.69,0.49 0.49,0.69 0.32,0.92 0.18,1.17 0.08,1.44 0.02,1.72 0,2

Small or netless copper shapes (teardrops, artwork), in the pictures only: 105 on Top Layer, 24 on Bottom Layer

## Text on the board
Bottom Silkscreen Layer: JLCJLCJLCJLC | 喇叭 | GND | - | 麦克风 | +
Top Silkscreen Layer: VCC | GND | SCL | SDA | 5V | 屏幕 | 2022011245 | +
